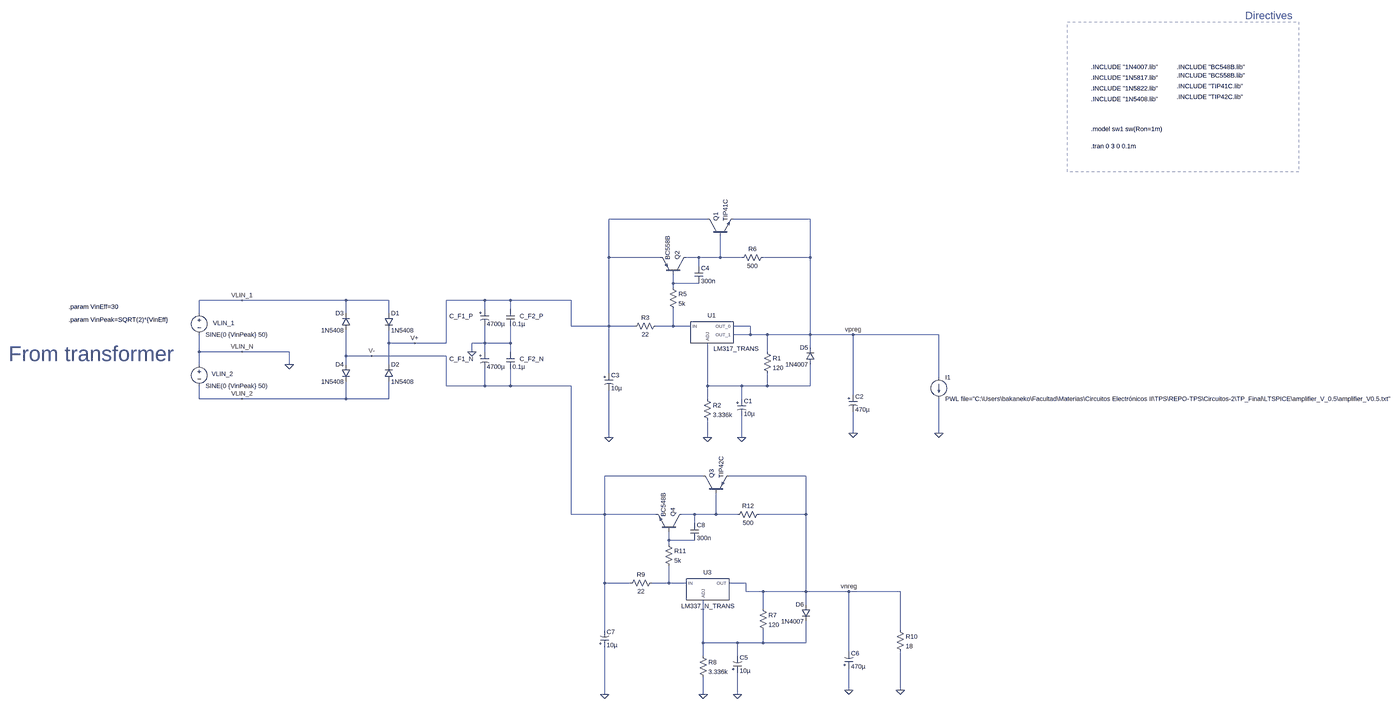
[diagram p0: schematic power_supply_B_V_0.1.asc, whole sheet]
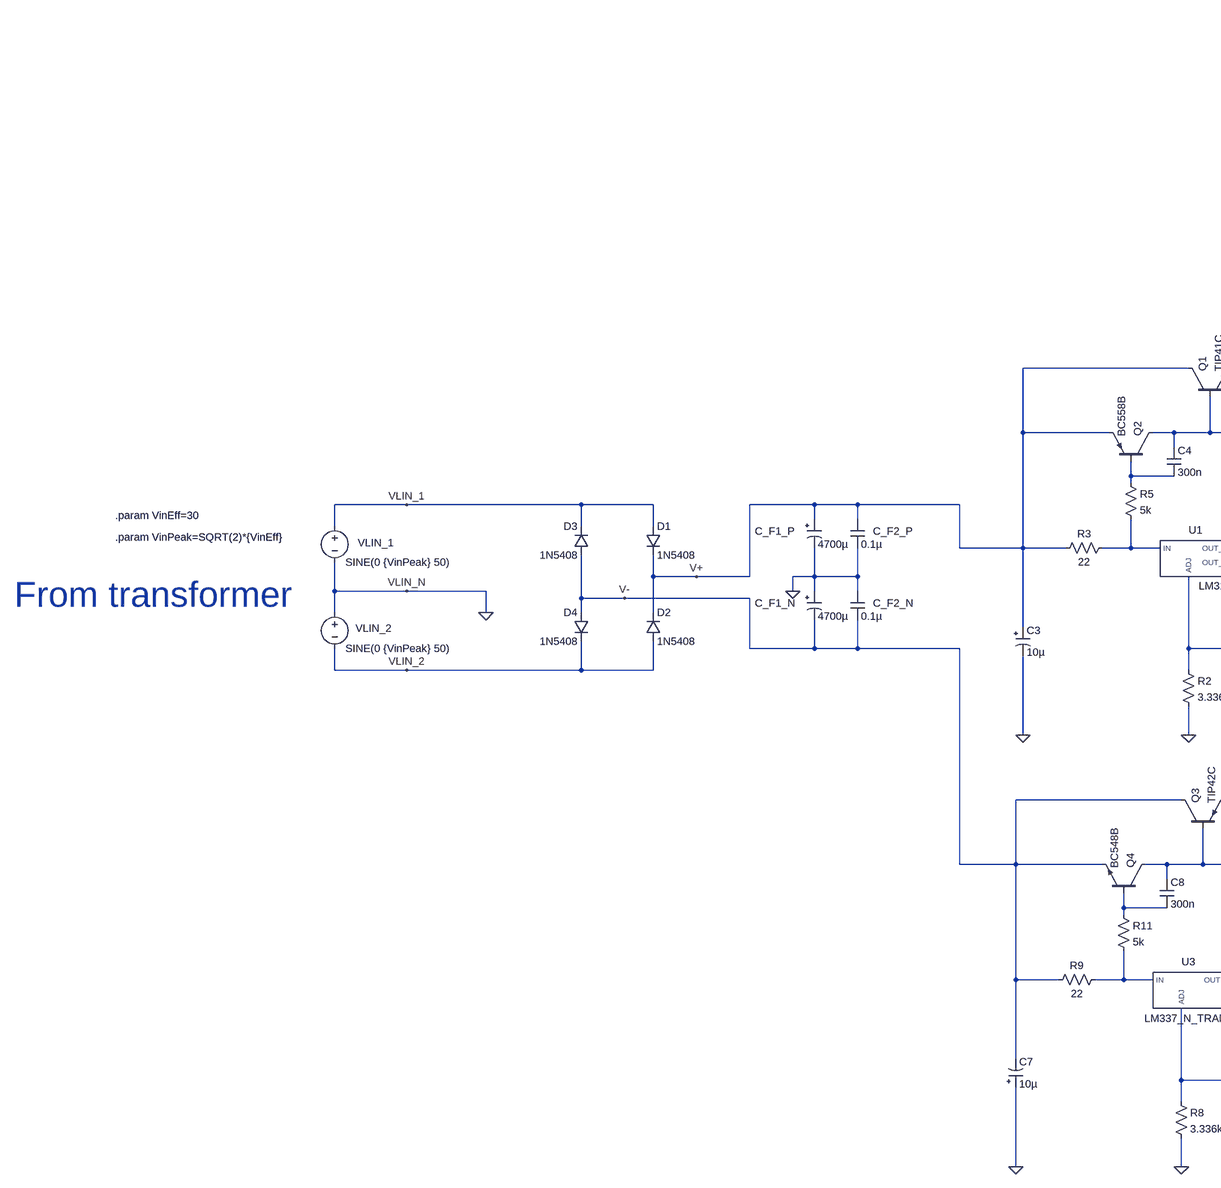
[diagram p1: schematic power_supply_B_V_0.1.asc, part, row 1 of 1, column 1 of 2]
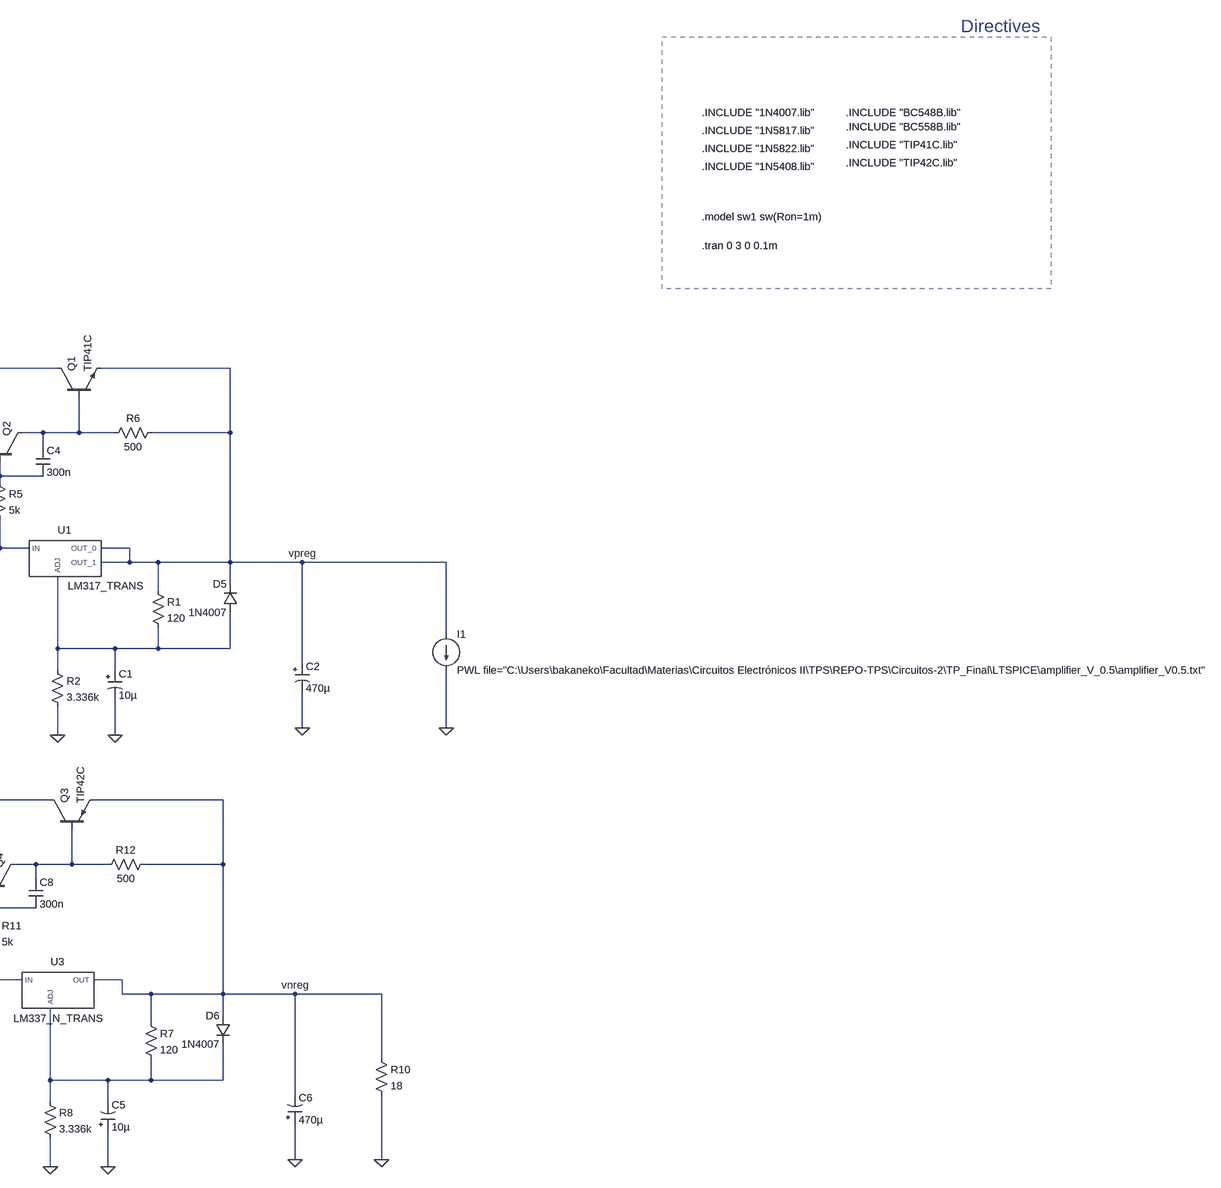
[diagram p2: schematic power_supply_B_V_0.1.asc, part, row 1 of 1, column 2 of 2]
power_supply_B_V_0.1.asc, the LTspice schematic file:
Version 4
SHEET 1 5104 948
WIRE 2480 -848 2112 -848
WIRE 2864 -848 2576 -848
WIRE 2112 -704 2112 -848
WIRE 2304 -704 2112 -704
WIRE 2448 -704 2400 -704
WIRE 2528 -704 2528 -784
WIRE 2528 -704 2448 -704
WIRE 2608 -704 2528 -704
WIRE 2864 -704 2864 -848
WIRE 2864 -704 2688 -704
WIRE 2448 -672 2448 -704
WIRE 2352 -608 2352 -640
WIRE 2448 -608 2352 -608
WIRE 2352 -592 2352 -608
WIRE -96 -544 -256 -544
WIRE 752 -544 -96 -544
WIRE 912 -544 752 -544
WIRE 1280 -544 1136 -544
WIRE 1376 -544 1280 -544
WIRE 1696 -544 1376 -544
WIRE 1280 -512 1280 -544
WIRE 1376 -512 1376 -544
WIRE -256 -496 -256 -544
WIRE 752 -496 752 -544
WIRE 912 -496 912 -544
WIRE 1696 -448 1696 -544
WIRE 2112 -448 2112 -704
WIRE 2112 -448 1696 -448
WIRE 2208 -448 2112 -448
WIRE 2352 -448 2352 -512
WIRE 2352 -448 2288 -448
WIRE 2416 -448 2352 -448
WIRE 2640 -448 2576 -448
WIRE 2640 -416 2640 -448
WIRE 2640 -416 2576 -416
WIRE 2704 -416 2640 -416
WIRE 2864 -416 2864 -704
WIRE 2864 -416 2704 -416
WIRE 3024 -416 2864 -416
WIRE 3344 -416 3024 -416
WIRE 912 -384 912 -432
WIRE 1008 -384 912 -384
WIRE 1136 -384 1136 -544
WIRE 1136 -384 1008 -384
WIRE 1280 -384 1280 -448
WIRE 1280 -384 1232 -384
WIRE 1376 -384 1376 -448
WIRE 1376 -384 1280 -384
WIRE 2864 -368 2864 -416
WIRE -256 -352 -256 -416
WIRE -96 -352 -256 -352
WIRE 80 -352 -96 -352
WIRE 1232 -352 1232 -384
WIRE 1280 -352 1280 -384
WIRE 1376 -352 1376 -384
WIRE 2704 -352 2704 -416
WIRE 752 -336 752 -432
WIRE 848 -336 752 -336
WIRE 1136 -336 848 -336
WIRE -256 -304 -256 -352
WIRE 80 -304 80 -352
WIRE 752 -304 752 -336
WIRE 912 -304 912 -384
WIRE 2112 -272 2112 -448
WIRE 3344 -256 3344 -416
WIRE 1136 -224 1136 -336
WIRE 1280 -224 1280 -288
WIRE 1280 -224 1136 -224
WIRE 1376 -224 1376 -288
WIRE 1376 -224 1280 -224
WIRE 1696 -224 1376 -224
WIRE 2480 -224 2480 -384
WIRE 2608 -224 2480 -224
WIRE 2704 -224 2704 -272
WIRE 2704 -224 2608 -224
WIRE 2864 -224 2864 -304
WIRE 2864 -224 2704 -224
WIRE 3024 -192 3024 -416
WIRE -256 -176 -256 -224
WIRE -96 -176 -256 -176
WIRE 752 -176 752 -240
WIRE 752 -176 -96 -176
WIRE 912 -176 912 -240
WIRE 912 -176 752 -176
WIRE 2480 -176 2480 -224
WIRE 2608 -176 2608 -224
WIRE 3024 -48 3024 -128
WIRE 3344 -48 3344 -176
WIRE 2112 -32 2112 -208
WIRE 2480 -32 2480 -96
WIRE 2608 -32 2608 -112
WIRE 2464 112 2096 112
WIRE 2848 112 2560 112
WIRE 1696 256 1696 -224
WIRE 2096 256 2096 112
WIRE 2096 256 1696 256
WIRE 2288 256 2096 256
WIRE 2432 256 2384 256
WIRE 2512 256 2512 176
WIRE 2512 256 2432 256
WIRE 2592 256 2512 256
WIRE 2848 256 2848 112
WIRE 2848 256 2672 256
WIRE 2432 288 2432 256
WIRE 2336 352 2336 320
WIRE 2432 352 2336 352
WIRE 2336 368 2336 352
WIRE 2096 512 2096 256
WIRE 2192 512 2096 512
WIRE 2336 512 2336 448
WIRE 2336 512 2272 512
WIRE 2400 512 2336 512
WIRE 2624 512 2560 512
WIRE 2624 544 2624 512
WIRE 2688 544 2624 544
WIRE 2848 544 2848 256
WIRE 2848 544 2688 544
WIRE 3008 544 2848 544
WIRE 3200 544 3008 544
WIRE 2848 592 2848 544
WIRE 2688 608 2688 544
WIRE 2096 688 2096 512
WIRE 3200 688 3200 544
WIRE 2464 736 2464 576
WIRE 2592 736 2464 736
WIRE 2688 736 2688 688
WIRE 2688 736 2592 736
WIRE 2848 736 2848 656
WIRE 2848 736 2688 736
WIRE 3008 768 3008 544
WIRE 2464 784 2464 736
WIRE 2592 784 2592 736
WIRE 3008 912 3008 832
WIRE 3200 912 3200 768
WIRE 2096 928 2096 752
WIRE 2464 928 2464 864
WIRE 2592 928 2592 848
FLAG -96 -544 VLIN_1
FLAG -96 -176 VLIN_2
FLAG -96 -352 VLIN_N
FLAG 80 -304 0
FLAG 848 -336 V-
FLAG 1008 -384 V+
FLAG 1232 -352 0
FLAG 2480 -32 0
FLAG 2608 -32 0
FLAG 3024 -48 0
FLAG 3344 -48 0
FLAG 2112 -32 0
FLAG 3024 -416 vpreg
FLAG 2464 928 0
FLAG 2592 928 0
FLAG 3008 912 0
FLAG 3200 912 0
FLAG 2096 928 0
FLAG 3008 544 vnreg
SYMBOL voltage -256 -512 R0
WINDOW 123 0 0 Left 2
WINDOW 39 0 0 Left 2
WINDOW 0 51 53 Left 2
SYMATTR InstName VLIN_1
SYMATTR Value SINE(0 {VinPeak} 50)
SYMBOL diode 896 -496 R0
SYMATTR InstName D1
SYMATTR Value 1N5408
SYMBOL diode 896 -240 M180
WINDOW 0 24 64 Left 2
WINDOW 3 24 0 Left 2
SYMATTR InstName D2
SYMATTR Value 1N5408
SYMBOL polcap 1264 -512 R0
WINDOW 0 -116 27 Left 2
WINDOW 3 24 56 Left 2
SYMATTR InstName C_F1_P
SYMATTR Value 4700µ
SYMATTR Description Capacitor
SYMATTR Type cap
SYMATTR SpiceLine V=35 Irms=1.45 Rser=0.044 Lser=0 mfg="Nichicon" pn="UPR1V222MRH" type="Al electrolytic"
SYMBOL cap 1360 -512 R0
WINDOW 0 50 27 Left 2
SYMATTR InstName C_F2_P
SYMATTR Value 0.1µ
SYMATTR SpiceLine V=4 Irms=1.62 Rser=0.0464862 Lser=0 mfg="KEMET" pn="C0402C104K7PAC" type="X5R"
SYMBOL diode 768 -432 R180
WINDOW 0 24 64 Left 2
WINDOW 3 24 0 Left 2
SYMATTR InstName D3
SYMATTR Value 1N5408
SYMBOL diode 768 -304 M0
SYMATTR InstName D4
SYMATTR Value 1N5408
SYMBOL voltage -256 -320 R0
WINDOW 123 0 0 Left 2
WINDOW 39 0 0 Left 2
WINDOW 0 46 51 Left 2
SYMATTR InstName VLIN_2
SYMATTR Value SINE(0 {VinPeak} 50)
SYMBOL polcap 1264 -352 R0
WINDOW 0 -116 27 Left 2
WINDOW 3 24 56 Left 2
SYMATTR InstName C_F1_N
SYMATTR Value 4700µ
SYMATTR Description Capacitor
SYMATTR Type cap
SYMATTR SpiceLine V=35 Irms=1.45 Rser=0.044 Lser=0 mfg="Nichicon" pn="UPR1V222MRH" type="Al electrolytic"
SYMBOL cap 1360 -352 R0
WINDOW 0 50 27 Left 2
SYMATTR InstName C_F2_N
SYMATTR Value 0.1µ
SYMATTR SpiceLine V=4 Irms=1.62 Rser=0.0464862 Lser=0 mfg="KEMET" pn="C0402C104K7PAC" type="X5R"
SYMBOL LM317_TRANS 2496 -432 R0
WINDOW 3 91 53 Top 2
SYMATTR InstName U1
SYMBOL diode 2880 -304 R180
WINDOW 0 24 64 Left 2
WINDOW 3 24 0 Left 2
SYMATTR InstName D5
SYMATTR Value 1N4007
SYMBOL res 2688 -368 R0
SYMATTR InstName R1
SYMATTR Value 120
SYMBOL polcap 2592 -176 R0
SYMATTR InstName C1
SYMATTR Value 10µ
SYMBOL res 2464 -192 R0
SYMATTR InstName R2
SYMATTR Value 3.336k
SYMBOL res 2304 -464 R90
WINDOW 0 0 56 VBottom 2
WINDOW 3 32 56 VTop 2
SYMATTR InstName R3
SYMATTR Value 22
SYMBOL polcap 3008 -192 R0
SYMATTR InstName C2
SYMATTR Value 470µ
SYMBOL res 2336 -608 R0
SYMATTR InstName R5
SYMATTR Value 5k
SYMBOL res 2704 -720 R90
WINDOW 0 0 56 VBottom 2
WINDOW 3 32 56 VTop 2
SYMATTR InstName R6
SYMATTR Value 500
SYMBOL pnp 2400 -640 M270
SYMATTR InstName Q2
SYMATTR Value BC558B
SYMBOL npn 2480 -784 R270
SYMATTR InstName Q1
SYMATTR Value TIP41C
SYMBOL polcap 2096 -272 R0
SYMATTR InstName C3
SYMATTR Value 10µ
SYMBOL cap 2432 -672 R0
SYMATTR InstName C4
SYMATTR Value 300n
SYMBOL diode 2864 592 M0
SYMATTR InstName D6
SYMATTR Value 1N4007
SYMBOL res 2672 592 R0
SYMATTR InstName R7
SYMATTR Value 120
SYMBOL polcap 2576 848 M180
WINDOW 0 24 57 Left 2
WINDOW 3 24 8 Left 2
SYMATTR InstName C5
SYMATTR Value 10µ
SYMBOL res 2448 768 R0
SYMATTR InstName R8
SYMATTR Value 3.336k
SYMBOL res 2288 496 R90
WINDOW 0 0 56 VBottom 2
WINDOW 3 32 56 VTop 2
SYMATTR InstName R9
SYMATTR Value 22
SYMBOL polcap 2992 832 M180
WINDOW 0 24 57 Left 2
WINDOW 3 24 8 Left 2
SYMATTR InstName C6
SYMATTR Value 470µ
SYMBOL res 3184 672 R0
SYMATTR InstName R10
SYMATTR Value 18
SYMBOL res 2320 352 R0
SYMATTR InstName R11
SYMATTR Value 5k
SYMBOL res 2688 240 R90
WINDOW 0 0 56 VBottom 2
WINDOW 3 32 56 VTop 2
SYMATTR InstName R12
SYMATTR Value 500
SYMBOL pnp 2464 176 R270
SYMATTR InstName Q3
SYMATTR Value TIP42C
SYMBOL npn 2384 320 M270
SYMATTR InstName Q4
SYMATTR Value BC548B
SYMBOL polcap 2080 752 M180
WINDOW 0 24 57 Left 2
WINDOW 3 24 8 Left 2
SYMATTR InstName C7
SYMATTR Value 10µ
SYMBOL cap 2416 288 R0
SYMATTR InstName C8
SYMATTR Value 300n
SYMBOL LM337_N_TRANS 2480 528 R0
SYMATTR InstName U3
SYMBOL current 3344 -256 R0
WINDOW 123 0 0 Left 0
WINDOW 39 0 0 Left 0
SYMATTR InstName I1
SYMATTR Value PWL file="C:\Users\bakaneko\Facultad\Materias\Circuitos Electrónicos II\TPS\REPO-TPS\Circuitos-2\TP_Final\LTSPICE\amplifier_V_0.5\amplifier_V0.5.txt"
TEXT -968 -344 Left 6 ;From transformer
TEXT 3912 -1232 Left 2 !.tran 0 3 0 0.1m
TEXT 3912 -1528 Left 2 !.INCLUDE "1N4007.lib"
TEXT 3912 -1488 Left 2 !.INCLUDE "1N5817.lib"
TEXT 3912 -1448 Left 2 !.INCLUDE "1N5822.lib"
TEXT 3912 -1296 Left 2 !.model sw1 sw(Ron=1m)
TEXT 4488 -1720 Left 4 ;Directives
TEXT 3912 -1408 Left 2 !.INCLUDE "1N5408.lib"
TEXT -744 -520 Left 2 !.param VinEff=30
TEXT -744 -472 Left 2 !.param VinPeak=SQRT(2)*{VinEff}
TEXT 4232 -1528 Left 2 !.INCLUDE "BC548B.lib"
TEXT 4232 -1496 Left 2 !.INCLUDE "BC558B.lib"
TEXT 4232 -1456 Left 2 !.INCLUDE "TIP41C.lib"
TEXT 4232 -1416 Left 2 !.INCLUDE "TIP42C.lib"
RECTANGLE Normal 4688 -1136 3824 -1696 3

The netlist it stands for:
* power_supply_B_V_0.1.asc
VLIN_1 VLIN_1 0 SINE(0 {VinPeak} 50)
D1 VLIN_1 V+ 1N5408
D2 VLIN_2 V+ 1N5408
C_F1_P V+ 0 4700µ V=35 Irms=1.45 Rser=0.044 Lser=0 mfg="Nichicon" pn="UPR1V222MRH" type="Al electrolytic"
C_F2_P V+ 0 0.1µ V=4 Irms=1.62 Rser=0.0464862 Lser=0 mfg="KEMET" pn="C0402C104K7PAC" type="X5R"
D3 V- VLIN_1 1N5408
D4 V- VLIN_2 1N5408
VLIN_2 0 VLIN_2 SINE(0 {VinPeak} 50)
C_F1_N 0 V- 4700µ V=35 Irms=1.45 Rser=0.044 Lser=0 mfg="Nichicon" pn="UPR1V222MRH" type="Al electrolytic"
C_F2_N 0 V- 0.1µ V=4 Irms=1.62 Rser=0.0464862 Lser=0 mfg="KEMET" pn="C0402C104K7PAC" type="X5R"
XU1 N003 N004 vpreg vpreg LM317_TRANS  ; pins IN ADJ OUT_0 OUT_1
D5 N004 vpreg 1N4007
R1 vpreg N004 120
C1 N004 0 10µ
R2 N004 0 3.336k
R3 N003 V+ 22
C2 vpreg 0 470µ
R5 N002 N003 5k
R6 vpreg N001 500
Q2 N001 N002 V+ 0 BC558B
Q1 V+ N001 vpreg 0 TIP41C
C3 V+ 0 10µ
C4 N001 N002 300n
D6 vnreg N008 1N4007
R7 vnreg N008 120
C5 0 N008 10µ
R8 N008 0 3.336k
R9 N007 V- 22
C6 0 vnreg 470µ
R10 vnreg 0 18
R11 N006 N007 5k
R12 vnreg N005 500
Q3 V- N005 vnreg 0 TIP42C
Q4 N005 N006 V- 0 BC548B
C7 0 V- 10µ
C8 N005 N006 300n
XU3 N007 N008 vnreg LM337_N_TRANS  ; pins IN ADJ OUT
I1 vpreg 0 PWL file="C:\Users\bakaneko\Facultad\Materias\Circuitos Electrónicos II\TPS\REPO-TPS\Circuitos-2\TP_Final\LTSPICE\amplifier_V_0.5\amplifier_V0.5.txt"
.model D D
.lib standard.dio
.model NPN NPN
.model PNP PNP
.lib standard.bjt
* From transformer
.tran 0 3 0 0.1m
.INCLUDE "1N4007.lib"
.INCLUDE "1N5817.lib"
.INCLUDE "1N5822.lib"
.model sw1 sw(Ron=1m)
* Directives
.INCLUDE "1N5408.lib"
.param VinEff=30
.param VinPeak=SQRT(2)*{VinEff}
.INCLUDE "BC548B.lib"
.INCLUDE "BC558B.lib"
.INCLUDE "TIP41C.lib"
.INCLUDE "TIP42C.lib"
.lib LM317_TRANS.LIB
.lib LM337_N_TRANS.LIB
.backanno
.end